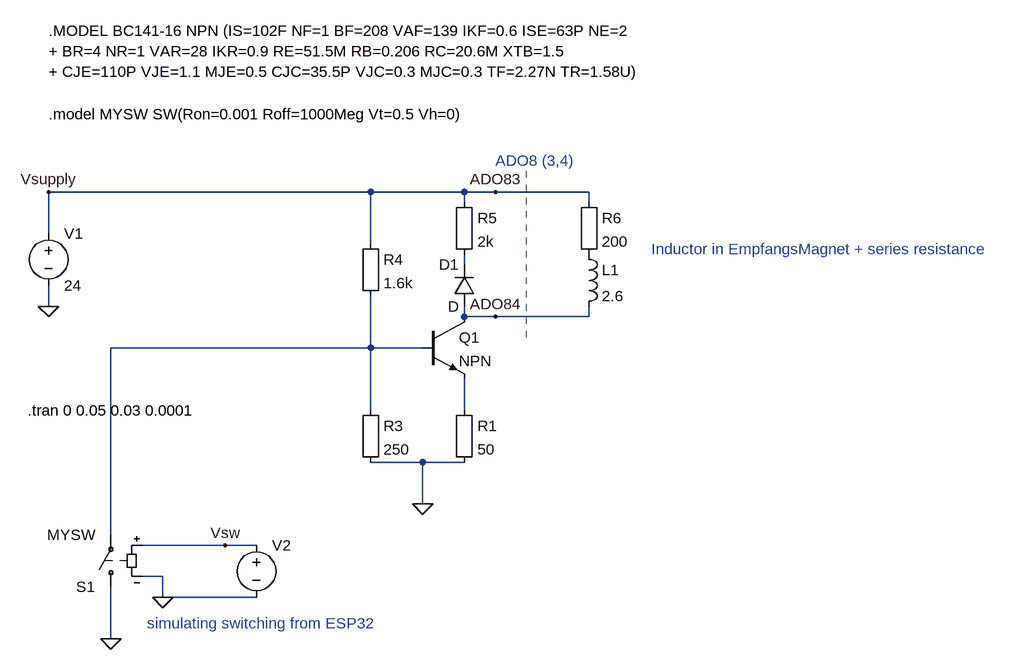
[diagram p0: schematic current_source.asc]
current_source.asc, the LTspice schematic file:
Version 4
SHEET 1 1636 916
WIRE 624 64 128 64
WIRE 768 64 624 64
WIRE 816 64 768 64
WIRE 960 64 816 64
WIRE 768 80 768 64
WIRE 960 80 960 64
WIRE 128 128 128 64
WIRE 624 144 624 64
WIRE 768 176 768 160
WIRE 128 240 128 208
WIRE 768 256 768 240
WIRE 816 256 768 256
WIRE 960 256 960 240
WIRE 960 256 816 256
WIRE 624 304 624 224
WIRE 624 304 224 304
WIRE 704 304 624 304
WIRE 624 400 624 304
WIRE 768 400 768 352
WIRE 704 480 624 480
WIRE 768 480 704 480
WIRE 704 544 704 480
WIRE 224 592 224 304
WIRE 400 608 272 608
WIRE 448 608 400 608
WIRE 304 656 272 656
WIRE 304 688 304 656
WIRE 448 688 304 688
WIRE 224 752 224 672
FLAG 128 240 0
FLAG 304 688 0
FLAG 128 64 Vsupply
FLAG 400 608 Vsw
FLAG 704 544 0
FLAG 224 752 0
FLAG 816 256 ADO84
FLAG 816 64 ADO83
SYMBOL voltage 128 112 R0
WINDOW 123 0 0 Left 0
WINDOW 39 0 0 Left 0
SYMATTR InstName V1
SYMATTR Value 24
SYMBOL sw 224 688 R180
SYMATTR InstName S1
SYMATTR Value MYSW
SYMBOL voltage 448 592 R0
WINDOW 3 24 96 Invisible 2
WINDOW 123 0 0 Left 0
WINDOW 39 0 0 Left 0
SYMATTR Value PWL(0 0.0 0.009 0 0.01 1 0.019 1 0.02 0 0.039 0 0.04 1 0.079 1 0.08 0)
SYMATTR InstName V2
SYMBOL ind 944 144 R0
SYMATTR InstName L1
SYMATTR Value 2.6
SYMBOL npn3 704 256 R0
SYMATTR InstName Q1
SYMBOL Misc\\EuropeanResistor 752 384 R0
SYMATTR InstName R1
SYMATTR Value 50
SYMBOL Misc\\EuropeanResistor 608 384 R0
SYMATTR InstName R3
SYMATTR Value 250
SYMBOL Misc\\EuropeanResistor 608 128 R0
SYMATTR InstName R4
SYMATTR Value 1.6k
SYMBOL diode 784 240 R180
WINDOW 0 24 64 Left 2
WINDOW 3 24 0 Left 2
SYMATTR InstName D1
SYMBOL Misc\\EuropeanResistor 752 64 R0
SYMATTR InstName R5
SYMATTR Value 2k
SYMBOL Misc\\EuropeanResistor 944 64 R0
SYMATTR InstName R6
SYMATTR Value 200
TEXT 1056 152 Left 2 ;Inductor in EmpfangsMagnet + series resistance
TEXT 96 400 Left 2 !.tran 0 0.05 0.03 0.0001
TEXT 128 -56 Left 2 !.model MYSW SW(Ron=0.001 Roff=1000Meg Vt=0.5 Vh=0)
TEXT 280 728 Left 2 ;simulating switching from ESP32
TEXT 816 16 Left 2 ;ADO8 (3,4)
TEXT 128 -184 Left 2 !.MODEL BC141-16 NPN (IS=102F NF=1 BF=208 VAF=139 IKF=0.6 ISE=63P NE=2\n+ BR=4 NR=1 VAR=28 IKR=0.9 RE=51.5M RB=0.206 RC=20.6M XTB=1.5\n+ CJE=110P VJE=1.1 MJE=0.5 CJC=35.5P VJC=0.3 MJC=0.3 TF=2.27N TR=1.58U)
LINE Normal 864 288 864 32 2
LINE Normal 864 288 864 288 2
LINE Normal 864 288 864 288 2

The netlist it stands for:
* current_source.asc
V1 ADO83 0 24
S1 0 N002 Vsw 0 MYSW
V2 Vsw 0 PWL(0 0.0 0.009 0 0.01 1 0.019 1 0.02 0 0.039 0 0.04 1 0.079 1 0.08 0)
L1 P001 ADO84 2.6
Q1 ADO84 N002 N003 0 NPN
R1 N003 0 50
R3 N002 0 250
R4 ADO83 N002 1.6k
D1 ADO84 N001 D
R5 ADO83 N001 2k
R6 ADO83 P001 200
.model D D
.lib standard.dio
.model NPN NPN
.model PNP PNP
.lib standard.bjt
* Inductor in EmpfangsMagnet + series resistance
.tran 0 0.05 0.03 0.0001
.model MYSW SW(Ron=0.001 Roff=1000Meg Vt=0.5 Vh=0)
* simulating switching from ESP32
* ADO8 (3,4)
.MODEL BC141-16 NPN (IS=102F NF=1 BF=208 VAF=139 IKF=0.6 ISE=63P NE=2
+ BR=4 NR=1 VAR=28 IKR=0.9 RE=51.5M RB=0.206 RC=20.6M XTB=1.5
+ CJE=110P VJE=1.1 MJE=0.5 CJC=35.5P VJC=0.3 MJC=0.3 TF=2.27N TR=1.58U)
.backanno
.end